# Altium schematic sheet FPGA_TSK52B_WD_PWM8_W.SchDoc: FPGA TSK52B_WD PWM8_W example
size B; Organization: Altium Limited; Address1: L3, 12a Rodborough Rd; Address2: Frenchs Forest; Address3: NSW; Address4: Australia 2086; DocumentNumber: 1; SheetNumber: 1; SheetTotal: 2
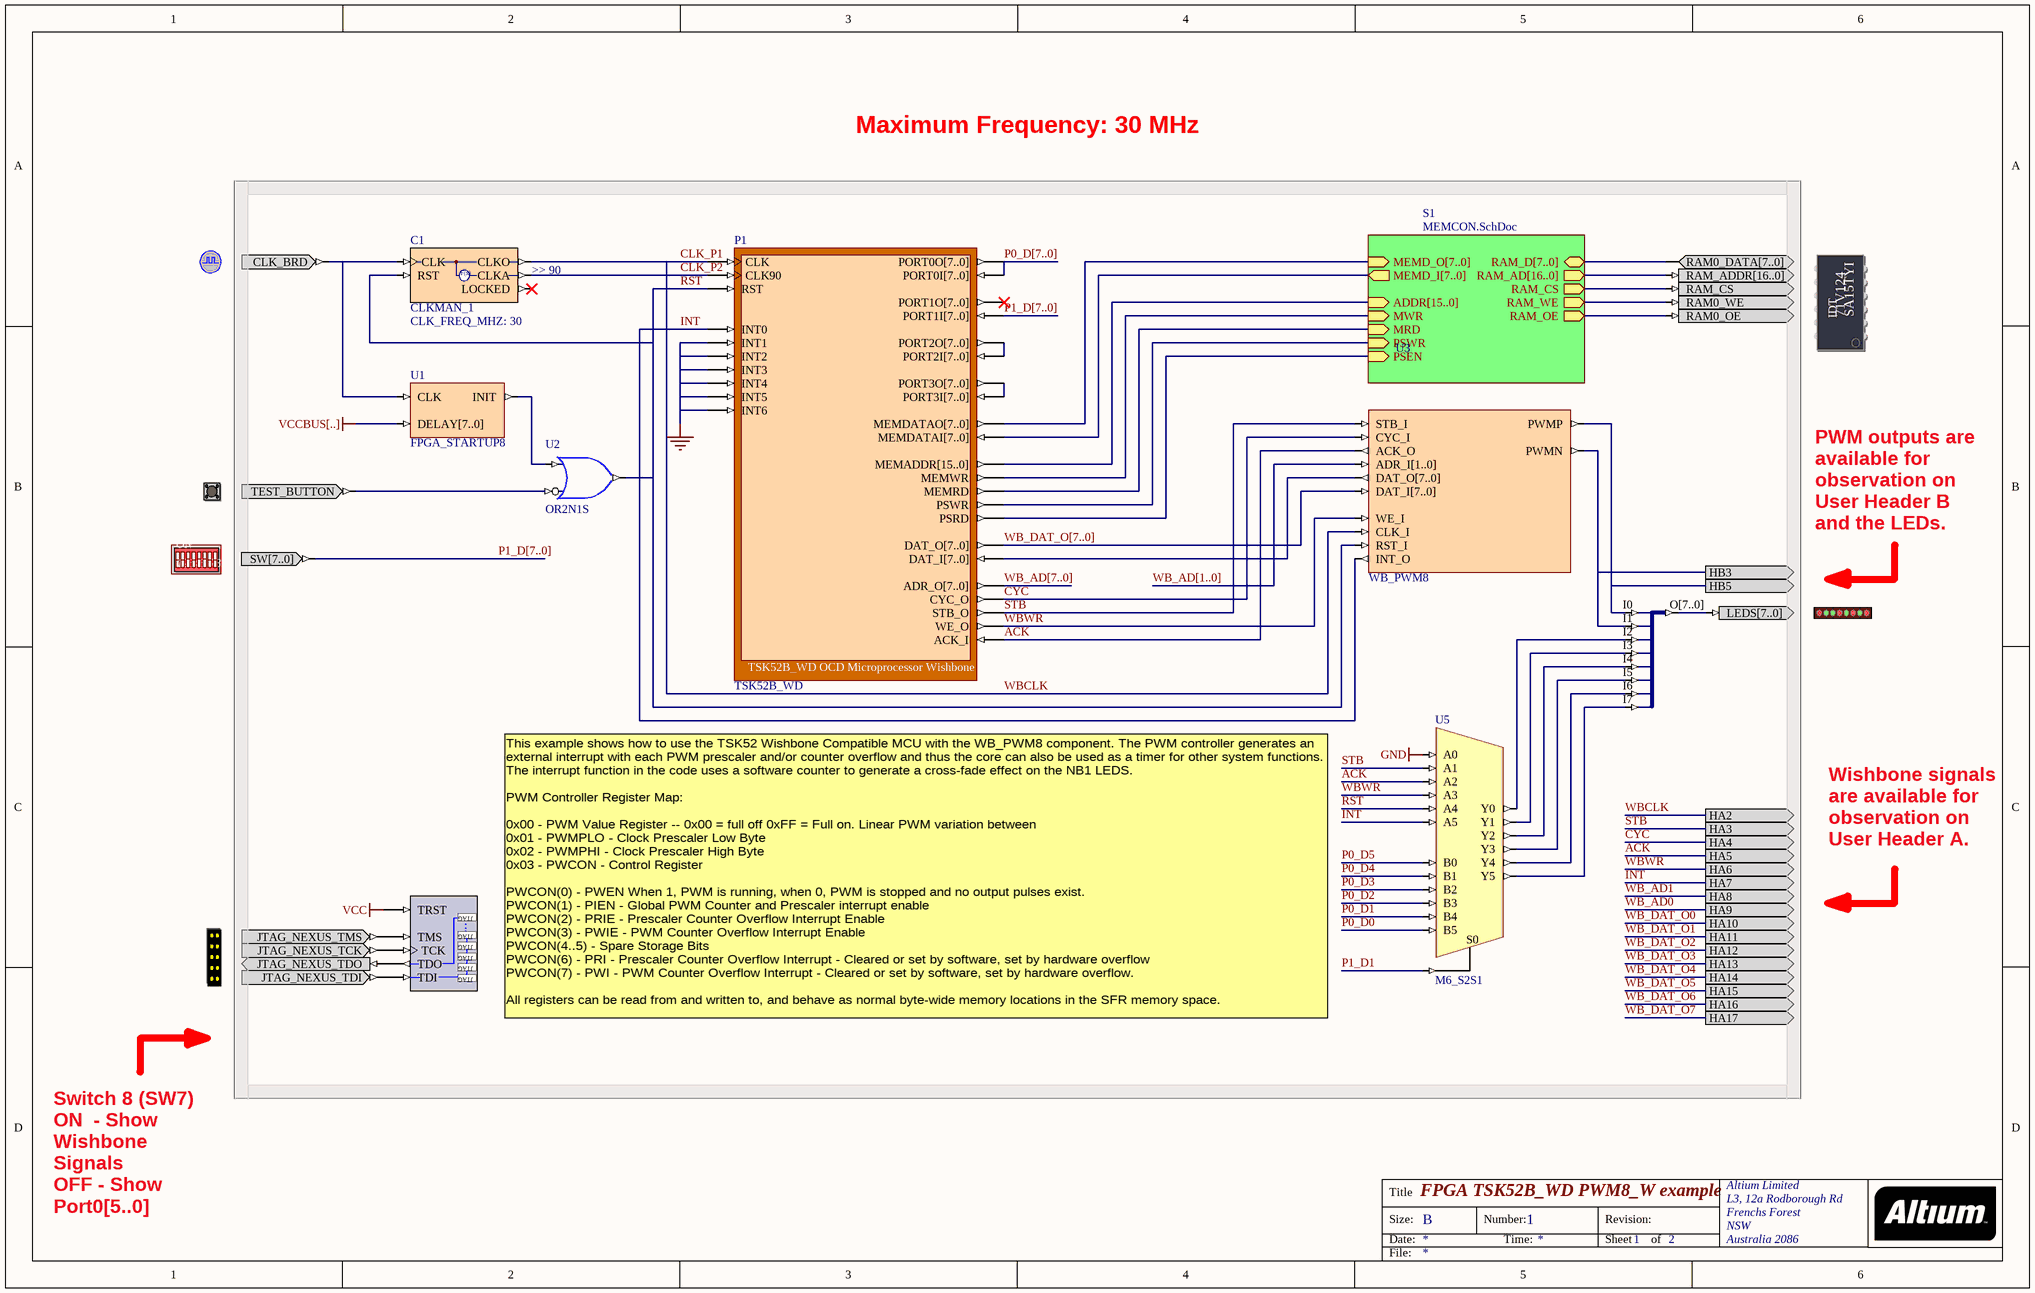
[diagram p0: FPGA_TSK52B_WD_PWM8_W.SchDoc]

## Parts
(Parts that share a designator on the sheet are numbered #1, #2 ... from top to bottom, then left to right.)
?#1  CLOCK_BOARD  (value not drawn)
?#2  MEMORY0  (value not drawn)
?#3  TEST_BUTTON  (value not drawn)
?#4  DIPSWITCH  (value not drawn)
?#5  LED  (value not drawn)
?#6  NEXUS_JTAG_CONNECTOR  (value not drawn)
C1  CLKMAN_1  CLK_FREQ_MHZ: 30  ClkA_Operation: >> 90
NEXUS_JTAG_PORT  NEXUS_JTAG_PORT  (value not drawn)
P1  TSK52B_WD
U1  FPGA_STARTUP8
U2  OR2N1S
U3  WB_PWM8
U4  J8S_8B  (value not drawn)
U5  M6_S2S1

## Sub-sheets
S1 = MEMCON.SchDoc: RAM_D[7..0] (bidir), RAM_AD[16..0] (out), RAM_CS (out), RAM_WE (out), RAM_OE (out), MEMD_O[7..0] (in), MEMD_I[7..0] (out), ADDR[15..0] (in), MWR (in), MRD (in), PSEN (in), PSWR (in)

## Ports
HA2 (out), HA3 (out), HA4 (out), HA5 (out), HA6 (out), HA7 (out), HA8 (out), HA9 (out), HA10 (out), HA11 (out), HA12 (out), HA13 (out), HA14 (out), HA15 (out), HA16 (out), HA17 (out), HB3 (out), HB5 (out)

## Nets
GND: P1.INT1 P1.INT2 P1.INT3 P1.INT4 P1.INT5 P1.INT6 U5.A0
VCC: NEXUS_JTAG_PORT.TRST
VCCBUS[..]: U1.DELAY[7..0]
ACK: P1.ACK_I U3.ACK_O U5.A2 ; port HA5
CLK_P1: C1.CLKO P1.CLK U3.CLK_I ; port HA2  [also labelled WBCLK]
CLK_P2: C1.CLKA P1.CLK90
CYC: P1.CYC_O U3.CYC_I ; port HA4
HB3: U3.PWMN U4.I1 ; port HB3
HB5: U3.PWMP U4.I0 ; port HB5
INT: P1.INT0 U3.INT_O U5.A5 ; port HA7
P0_D0: U5.B5
P0_D1: U5.B4
P0_D2: U5.B3
P0_D3: U5.B2
P0_D4: U5.B1
P0_D5: U5.B0
P0_D[7..0]: P1.PORT0I[7..0] P1.PORT0O[7..0]
P1_D1: U5.S0
P1_D[7..0]: ?#4.SW[7..0] P1.PORT1I[7..0]
RST: C1.RST P1.RST U2.O U3.RST_I U5.A4
STB: P1.STB_O U3.STB_I U5.A1 ; port HA3
WB_AD0: port HA9
WB_AD1: port HA8
WB_AD[1..0]: U3.ADR_I[1..0]
WB_AD[7..0]: P1.ADR_O[7..0]
WB_DAT_O0: port HA10
WB_DAT_O1: port HA11
WB_DAT_O2: port HA12
WB_DAT_O3: port HA13
WB_DAT_O4: port HA14
WB_DAT_O5: port HA15
WB_DAT_O6: port HA16
WB_DAT_O7: port HA17
WB_DAT_O[7..0]: P1.DAT_O[7..0] U3.DAT_I[7..0]
WBWR: P1.WE_O U3.WE_I U5.A3 ; port HA6
Net?#1_CLK_BRD: ?#1.CLK_BRD C1.CLK U1.CLK
Net?#2_RAM0_DATA[7..0]: ?#2.RAM0_DATA[7..0] ; sheet S1/RAM_D[7..0]
Net?#2_RAM0_OE: ?#2.RAM0_OE ; sheet S1/RAM_OE
Net?#2_RAM0_WE: ?#2.RAM0_WE ; sheet S1/RAM_WE
Net?#2_RAM_ADDR[16..0]: ?#2.RAM_ADDR[16..0] ; sheet S1/RAM_AD[16..0]
Net?#2_RAM_CS: ?#2.RAM_CS ; sheet S1/RAM_CS
Net?#3_TEST_BUTTON: ?#3.TEST_BUTTON U2.I0
Net?#5_LEDS[7..0]: ?#5.LEDS[7..0] U4.O[7..0]
Net?#6_JTAG_NEXUS_TCK: ?#6.JTAG_NEXUS_TCK NEXUS_JTAG_PORT.TCK
Net?#6_JTAG_NEXUS_TDI: ?#6.JTAG_NEXUS_TDI NEXUS_JTAG_PORT.TDI
Net?#6_JTAG_NEXUS_TDO: ?#6.JTAG_NEXUS_TDO NEXUS_JTAG_PORT.TDO
Net?#6_JTAG_NEXUS_TMS: ?#6.JTAG_NEXUS_TMS NEXUS_JTAG_PORT.TMS
NetP1_DAT_I[7..0]: P1.DAT_I[7..0] U3.DAT_O[7..0]
NetP1_MEMADDR[15..0]: P1.MEMADDR[15..0] ; sheet S1/ADDR[15..0]
NetP1_MEMDATAI[7..0]: P1.MEMDATAI[7..0] ; sheet S1/MEMD_I[7..0]
NetP1_MEMDATAO[7..0]: P1.MEMDATAO[7..0] ; sheet S1/MEMD_O[7..0]
NetP1_MEMRD: P1.MEMRD ; sheet S1/MRD
NetP1_MEMWR: P1.MEMWR ; sheet S1/MWR
NetP1_PORT2I[7..0]: P1.PORT2I[7..0] P1.PORT2O[7..0]
NetP1_PORT3I[7..0]: P1.PORT3I[7..0] P1.PORT3O[7..0]
NetP1_PSRD: P1.PSRD ; sheet S1/PSEN
NetP1_PSWR: P1.PSWR ; sheet S1/PSWR
NetU1_INIT: U1.INIT U2.I1
NetU4_I2: U4.I2 U5.Y0
NetU4_I3: U4.I3 U5.Y1
NetU4_I4: U4.I4 U5.Y2
NetU4_I5: U4.I5 U5.Y3
NetU4_I6: U4.I6 U5.Y4
NetU4_I7: U4.I7 U5.Y5

Not connected (* = marked no-connect by the designer): C1 LOCKED*; P1 PORT1O[7..0]*

## Buses and harness runs
bus P0_D[7..0]
bus P1_D[7..0]
bus WB_AD[1..0]
bus WB_AD[7..0]
bus WB_DAT_O[7..0]

## Notes on the sheet
- Maximum Frequency: 30 MHz
- PWM outputs are available for observation on User Header B and the LEDs.
- Wishbone signals are available for observation on User Header A.
- This example shows how to use the TSK52 Wishbone Compatible MCU with the WB_PWM8 component. The PWM controller generates an external interrupt with each PWM prescaler and/or counter overflow and thus the core can also be used as a timer for other system functions. The interrupt function in the code uses a software counter to generate a cross-fade effect on the NB1 LEDS.
  PWM Controller Register Map:
  0x00 - PWM Value Register -- 0x00 = full off 0xFF = Full on. Linear PWM variation between
  0x01 - PWMPLO - Clock Prescaler Low Byte
  0x02 - PWMPHI - Clock Prescaler High Byte
  0x03 - PWCON - Control Register
  PWCON(0) - PWEN When 1, PWM is running, when 0, PWM is stopped and no output pulses exist.
  PWCON(1) - PIEN - Global PWM Counter and Prescaler interrupt enable
  PWCON(2) - PRIE - Prescaler Counter Overflow Interrupt Enable
  PWCON(3) - PWIE - PWM Counter Overflow Interrupt Enable
  PWCON(4..5) - Spare Storage Bits
  PWCON(6) - PRI - Prescaler Counter Overflow Interrupt - Cleared or set by software, set by hardware overflow
  PWCON(7) - PWI - PWM Counter Overflow Interrupt - Cleared or set by software, set by hardware overflow.
  All registers can be read from and written to, and behave as normal byte-wide memory locations in the SFR memory space.
- Switch 8 (SW7)
  ON  - Show Wishbone Signals
  OFF - Show Port0[5..0]
- Title
- Size:
- Date:
- B
- Number:
- Time:
- Revision:
- Sheet
- of
- File:
- (in symbol CLKMAN_1) F(x)
- (in symbol DIPSWITCH) ON; 1; 2; 3; 4; 5; 6; 7; 8
- (in symbol MEMORY0) IDT; 71V124; SA15TYI
- (in symbol NEXUS_JTAG_PORT) .

## Library data of the parts
?#1 = CLOCK_BOARD: Global System Clock Supply; PortComponent: True; Published: 19-Nov-2003; Publisher: Altium Limited; HelpURL: TR0102 NanoBoard Technical Reference Manual - NB1.pdf#page=29
?#2 = MEMORY0: SRAM - 0 Module; PortComponent: True; Published: 19-Nov-2003; Publisher: Altium Limited; HelpURL: TR0102 NanoBoard Technical Reference Manual - NB1.pdf#page=33
?#3 = TEST_BUTTON: Test Button; PortComponent: True; Published: 19-Nov-2003; Publisher: Altium Limited; HelpURL: TR0102 NanoBoard Technical Reference Manual - NB1.pdf#page=41
?#4 = DIPSWITCH: 8-Way Dip Switch; PortComponent: True; Published: 19-Nov-2003; Publisher: Altium Limited; HelpURL: TR0102 NanoBoard Technical Reference Manual - NB1.pdf#page=41
?#5 = LED: 8-Way LEDS; PortComponent: True; Published: 19-Nov-2003; Publisher: Altium Limited; HelpURL: TR0102 NanoBoard Technical Reference Manual - NB1.pdf#page=41
?#6 = NEXUS_JTAG_CONNECTOR: JTAG Port; PortComponent: True; Published: 19-Nov-2003; Publisher: Altium Limited; HelpURL: TR0102 NanoBoard Technical Reference Manual - NB1.pdf#page=33
C1 = CLKMAN_1: Single Operational Output Clock Manager; Clk_Count: 1; Published: 5-Jul-2004; Publisher: Altium Limited; LastRevisionNo: 1.00.00; Nexus_Core: ClockManager; HelpURL: CR0118 FPGA Generic Library Guide.pdf#page=148; ComponentLink1URL: CR0128 FPGA Clock Manager Resource Usage.pdf#page=2; ComponentLink1Description: Core &Resource Usage; FunctionalClass: Clock Manager; PortSize: 1
NEXUS_JTAG_PORT = NEXUS_JTAG_PORT: Soft Nexus-Chain Connector; NEXUS_JTAG_CONNECTOR: True; FunctionalClass: JTAG; Published: 29-Jan-2004; Publisher: Altium Limited; LastRevisionNo: 1.00.00; HelpURL: CR0118 FPGA Generic Library Guide.pdf#page=399
P1 = TSK52B_WD: TSK52B_WD OCD Microprocessor Wishbone; NEXUS_CORE: Processor_OCDS; NEXUS_JTAG_DEVICE: True; NEXUS_JTAG_ORDER: 0; ChildModel1: TSK52B_WD_DRAM8X256; Memory_Configuration: Record[NEXUS_CORE]{}ComponentDesignator[iram]{}Memory_Depth[256]{}Memory_UsageType[ram]{}ProgramDownloadAddress[0x0]{}Memory_BusType[c51:idata_bus]{}Memory_Mau[8]{}Memory_MatchedComponent[]{}Memory_Description[]{}Memory_FillBitPattern[]{}Memory_Interrupts[]{n}Record[NEXUS_CORE]{}ComponentDesignator[xram]{}Memory_Depth[64k]{}Memory_UsageType[ram]{}ProgramDownloadAddress[0x0]{}Memory_BusType[c51:xdata_bus]{}Memory_Mau[8]{}Memory_MatchedComponent[]{}Memory_Description[]{}Memory_FillBitPattern[]{}Memory_Interrupts[]{n}Record[NEXUS_CORE]{}ComponentDesignator[xrom]{}Memory_Depth[64k]{}Memory_UsageType[rom]{}ProgramDownloadAddress[0x0]{}Memory_BusType[c51:code_bus]{}Memory_Mau[8]{}Memory_MatchedComponent[]{}Memory_Description[]{}Memory_FillBitPattern[]{}Memory_Interrupts[]{n}Record[CODE_EXPORT]{}ExportType[]{n}; Published: 17-Nov-2004; Publisher: Altium Limited; ComponentLink1Description: Core &Resource Usage; ComponentLink1URL: CR0140 FPGA Processor Resource Usage.pdf#page=7; HelpURL: CR0116 TSK52x MCU.pdf#page=4; LastRevisionNo: 1.00.00; ComponentLink2Description: Embedded &Tools Guide; ComponentLink2URL: GU0107 Using the TSK51x TSK52x Embedded Tools.pdf; ComponentLink3Description: Embedded T&echnical References; ComponentLink3URL: TR0105 TSK51x TSK52x Embedded Tools Reference.pdf
U1 = FPGA_STARTUP8: FPGA Startup With 8 Bit Delay; Published: 9-Dec-2004; Publisher: Altium Limited; HelpURL: CR0119 FPGA_STARTUPx Powerup Delay Unit.pdf#page=2; LastRevisionNo: 1.00.00; ComponentLink1Description: Core &Resource Usage; ComponentLink1URL: CR0139 FPGA Peripheral Resource Usage.pdf#page=9
U2 = OR2N1S: 2-Input OR Gate with Active Low A Input, Single Pin Version; XilinxEquivalent: OR2B1; FunctionalClass: Logic Primitive; PortSize: 2; ArchiveName: GENERIC; VHDLIB_SIM: GENERIC_LIB; Published: 29-Jan-2004; Publisher: Altium Limited; LastRevisionNo: 1.00.00; HelpURL: CR0118 FPGA Generic Library Guide.pdf#page=404; ComponentLink1URL: CR0136 FPGA Logic Primitive Resource Usage.pdf#page=187; ComponentLink1Description: Core &Resource Usage; SubClass: OR; PortStyle: Single Pin Version
U3 = WB_PWM8: Pulse Width Modulation Controller Wishbone; ComponentLink1Description: Core &Resource Usage; ComponentLink1URL: CR0139 FPGA Peripheral Resource Usage.pdf; HelpURL: CR0155 WB_PWM8 Pulse Width Modulation Controller.pdf; LastRevisionNo: 1.00.00; Published: 9-Mar-2005; Publisher: Altium Limited
U4 = J8S_8B: 8 Single pin inputs to single 8-Bit output bus; FunctionalClass: Bus Joiner; PortSize: 8; ArchiveName: GENERIC; VHDLIB_SIM: GENERIC_LIB; Published: 29-Jan-2004; Publisher: Altium Limited; LastRevisionNo: 1.00.00; HelpURL: CR0118 FPGA Generic Library Guide.pdf#page=305; ComponentLink1URL: CR0126 FPGA Bus Joiner Resource Usage.pdf#page=28; ComponentLink1Description: Core &Resource Usage
U5 = M6_S2S1: 2x6-Single Wire to 2x6-Single Wire Multiplexer; SubClass: SnS1; PortSize: 6; PortStyle: Single Pin Version; ArchiveName: GENERIC; VHDLIB_SIM: GENERIC_LIB; Published: 29-Jan-2004; Publisher: Altium Limited; LastRevisionNo: 1.00.00; HelpURL: CR0118 FPGA Generic Library Guide.pdf#page=360; ComponentLink1URL: CR0137 FPGA Multiplexer Resource Usage.pdf#page=254; ComponentLink1Description: Core &Resource Usage; FunctionalClass: Multiplexer